# Altium schematic sheet RaumluftsensorC3.SchDoc
size A4; DocumentNumber: 1; Revision: 0.1; SheetNumber: 1; SheetTotal: 1; HTL_Gruppe: I; HTL_Klasse: Klasse; HTL_Zusaetzlicher_Titel: zusätzlicher Titel; HTL_Schueler_Name: Max Mustermann; PageSetup: Record=PageOptions|CenterHorizontal=True|CenterVertical=True|PrintScale=1.00|XCorrection=1.00|YCorrection=1.00|PrintKind=0|BorderSize=5000000|LeftOffset=0|BottomOffset=0|Orientation=2|PaperLength=1000|PaperWidth=1000|Scale=100|PaperSource=7|PrintQuality=-4|MediaType=1|DitherType=10|PaperKind=A4|PrintScaleMode=1; HTL_Projektname: Projektname; HTL_Dokumentenart: Dokumentenart; HTL_Dokumentenstatus: Dokumentenstatus; SPICEModelCacheJVCKNDJX: <root> / <DocumentId>JVCKNDJX</DocumentId> / <CacheFrame Number="0"> / <Model Name="buz-171" Kind="CKT"> / <Text>******* / *SRC=BUZ-171;BUZ-171;MOSFETs P;Siemens;50V 8A 0.3 Ohm / *SYM=P-MOSFET / .SUBCKT BUZ-171 1 2 3 / LS 5 2 7N / LD 86 3 5N / RG 4 11 5.5M / RS 5 76 128M / D171 86 76 DREV / .MODEL DREV D CJO=1.5N RS=20M TT=29N IS=300P BV=50 / M171 86 11 76 76 MBUZ / .MODEL MBUZ PMOS VTO=-3.245 KP=0.973 / M2 11 86 8 8 MSW / .MODEL MSW PMOS VTO=-0.001 KP=5 / M3 86 11 8 8 MSW / COX 11 8 1.313N / DGD 86 8 DCGD / .MODEL DCGD D CJO=1.313N M=0.521 VJ=0.7 / CGS 76 11 0.85N / LG 4 1 7N / .ENDS</Text> / </Model> / </CacheFrame> / </root>
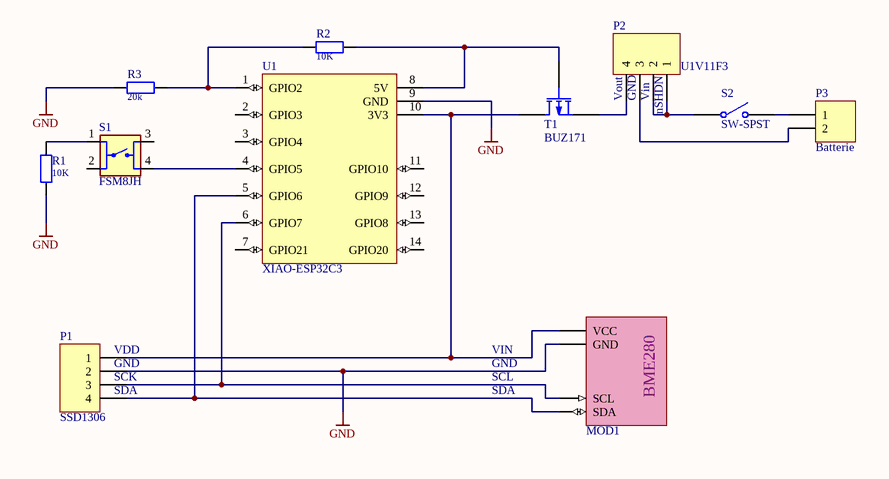
[diagram p0: RaumluftsensorC3.SchDoc]

## Parts
MOD1  BME280  [BME280]  (value not drawn)
P1  SSD1306  [HDR1X4]
P2  U1V11F3  [HDR1X4]
P3  Batterie  [HDR1X2]
R1  10K  [R_0207/RM4]
R2  10K  [R_0207/RM4]
R3  20k  [R_0207/RM4]
S1  FSM8JH  [SW_FSM8JH]
S2  SW-SPST  [SPST-2]
T1  BUZ171
U1  XIAO-ESP32C3  [PCBComponent_1]

## Nets
GND: MOD1.2(GND) P1.2 R1.1 R3.1 U1.9(GND)
NetMOD1_1: MOD1.1(VCC) P1.1 T1.3(D) U1.10(3V3)
NetMOD1_3: MOD1.3(SCL) P1.3 U1.6(GPIO7)
NetMOD1_4: MOD1.4(SDA) P1.4 U1.5(GPIO6)
NetP2_1: P2.1 P2.2 S2.1(COMMON)
NetP2_3: P2.3 P3.2
NetP2_4: P2.4 T1.2(S)
NetP3_1: P3.1 S2.2(NO)
NetR1_2: R1.2 S1.1
NetR2_1: R2.1 T1.1(G) U1.8(5V)
NetR2_2: R2.2 R3.2 U1.1(GPIO2)
NetS1_4: S1.4 U1.4(GPIO5)

Not connected (* = marked no-connect by the designer): S1 2 3; U1 2(GPIO3) 3(GPIO4) 7(GPIO21) 11(GPIO10) 12(GPIO9) 13(GPIO8) 14(GPIO20)

## Notes on the sheet
- (near P2) Vout
- (near P2) GND
- (near P2) Vin
- (near P2) nSHDN
- (near P1) VDD
- (near P1) GND
- (near P1) SCK
- GND
- VIN
- SCL
- (near P1) SDA
- SDA
- Sachnummer / Dateiname:
- Name:
- Gruppe:
- Klasse:
- Elektronik &
- Technische Informatik
- Anichstraße 26 - 28
- HTBLVA
- Titel:
- Datum:
- Dokumentenart:
- Dokumentenstatus:
- A - 6020 Innsbruck
- Ver.:
- Blatt:
- Blätter:

## Library data of the parts
MOD1 = BME280: Bosch BME280 Module GY-BME280-3.3; Usage: only permitted for non-commercial purposes at HTL I Innsbruck; Published: 06-Jan-2018; Publisher: Michael Kupfner; LatestRevisionDate: 06-Jan-2018
P1 = Header 4: OLED SSD1306 - Display; LatestRevisionDate: 17-Jul-2002; LatestRevisionNote: Re-released for DXP Platform.; Publisher: Altium Limited
P2 = Header 4: Pololu U1V11F3; LatestRevisionDate: 17-Jul-2002; LatestRevisionNote: Re-released for DXP Platform.; Publisher: Altium Limited
P3 = Header 2: Batteriehalter; LatestRevisionDate: 17-Jul-2002; LatestRevisionNote: Re-released for DXP Platform.; Publisher: Altium Limited
R1-R3 = R: Resistor; Usage: only permitted for non-commercial purposes at HTL I Innsbruck; Published: 21-Feb-2011; LatestRevisionDate: 07-Sep-2019
  R1 R2: Value: 10K
  R3: Value: 20k
S1 = FSM8JH: Tactile Switch SPST-NO Top Actuated Through Hole; MF: TE Connectivity; Check_prices: https://www.snapeda.com/parts/FSM8JH/TE+Connectivity+ALCOSWITCH+Switches/view-part/?ref=eda; Value: *; Availability: In Stock; MP: FSM8JH; Price: None; Package: None; SnapEDA_Link: https://www.snapeda.com/parts/FSM8JH/TE+Connectivity+ALCOSWITCH+Switches/view-part/?ref=snap
S2 = SW-SPST: Single-Pole, Single-Throw Switch; Published: 24-Mar-1999; LatestRevisionDate: 17-Jul-2002; LatestRevisionNote: Re-released for DXP Platform.; PackageReference: SPST-2; Publisher: Altium Limited; PackageDescription: Switch; 2 Leads
T1 = BUZ171: P-Channel MOSFET; Usage: only permitted for non-commercial purposes at HTL I Innsbruck; SimulationModellSource: Siemens (http://www.datasheetarchive.com/files/spicemodels/misc/modelos/spice_complete/buz_l0.lib); Published: 02-Apr-2018; LatestRevisionDate: 02-Apr-2018; Publisher: Michael Kupfner